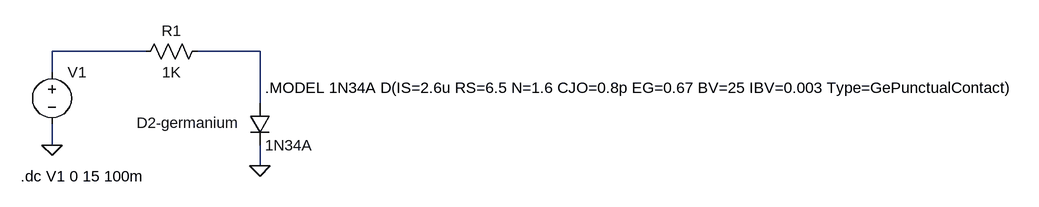
[diagram p0: schematic Germanium Diode_1.asc]
Germanium Diode_1.asc, the LTspice schematic file:
Version 4
SHEET 1 1432 680
WIRE 80 48 -64 48
WIRE 256 48 160 48
WIRE -64 80 -64 48
WIRE 256 128 256 48
WIRE -64 192 -64 160
WIRE 256 224 256 192
FLAG -64 192 0
FLAG 256 224 0
SYMBOL res 176 32 R90
WINDOW 0 0 56 VBottom 2
WINDOW 3 32 56 VTop 2
SYMATTR InstName R1
SYMATTR Value 1K
SYMATTR SpiceLine tol=1 pwr=0.1
SYMBOL diode 240 128 R0
WINDOW 0 -174 30 Left 2
SYMATTR InstName D2-germanium
SYMATTR Value 1N34A
SYMBOL voltage -64 64 R0
WINDOW 123 0 0 Left 2
WINDOW 39 24 124 Left 2
SYMATTR InstName V1
SYMATTR Value ""
TEXT -112 240 Left 2 !.dc V1 0 15 100m
TEXT 264 104 Left 2 !.MODEL 1N34A D(IS=2.6u RS=6.5 N=1.6 CJO=0.8p EG=0.67 BV=25 IBV=0.003 Type=GePunctualContact)

The netlist it stands for:
* Germanium Diode_1.asc
R1 N002 N001 1K tol=1 pwr=0.1
D2-germanium N002 0 1N34A
V1 N001 0
.model D D
.lib standard.dio
.dc V1 0 15 100m
.MODEL 1N34A D(IS=2.6u RS=6.5 N=1.6 CJO=0.8p EG=0.67 BV=25 IBV=0.003 Type=GePunctualContact)
.backanno
.end